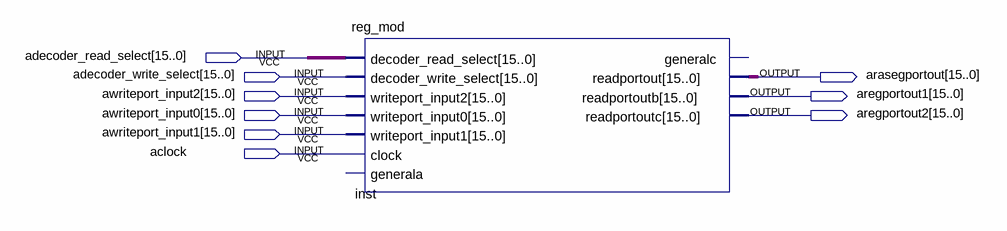
[diagram p0: schematic sheet]
// Quartus schematic simple_module_test_environment.bdf as structural Verilog: 1 symbols, 9 pins
module simple_module_test_environment (
  input  [15:0] adecoder_read_select,
  input  [15:0] adecoder_write_select,
  input  [15:0] awriteport_input2,
  input  [15:0] awriteport_input0,
  input  [15:0] awriteport_input1,
  input  aclock,
  output [15:0] arasegportout,
  output [15:0] aregportout1,
  output [15:0] aregportout2
);

  reg_mod inst (
    .decoder_read_select(adecoder_read_select), .decoder_write_select(adecoder_write_select),
    .writeport_input2(awriteport_input2), .writeport_input0(awriteport_input0),
    .writeport_input1(awriteport_input1), .clock(aclock), .readportout(arasegportout),
    .readportoutb(aregportout1), .readportoutc(aregportout2));  // open: generala, generalc
endmodule
